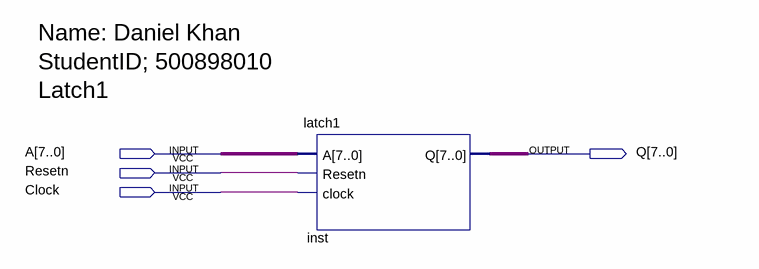
[diagram p0: schematic sheet]
// Quartus schematic Latch1schem.bdf as structural Verilog: 1 symbols, 4 pins
module Latch1schem (
  input  [7:0] A,
  input  Resetn,
  input  Clock,
  output [7:0] Q
);

  latch1 inst (.A(A), .clock(Clock), .Resetn(Resetn), .Q(Q));

  // Notes on the sheet:
  //   Name: Daniel Khan
  //   StudentID; 500898010
  //   Latch1
endmodule
